# Altium schematic sheet 03_POWER.SchDoc: =GlobalProjectName
size 594 x 420 mm; CheckedBy: A_D; Author: A_D; SheetNumber: 3; SheetTotal: 3; PageSetup: Record=PageOptions|CenterHorizontal=True|CenterVertical=True|PrintScale=0.70|XCorrection=1.00|YCorrection=1.00|PrintKind=2|BorderSize=5000000|LeftOffset=9000|BottomOffset=10100|Orientation=2|PaperLength=11176|PaperWidth=8636|Scale=100|PaperSource=259|PrintQuality=-3|MediaType=1|DitherType=10|PrintScaleMode=1|PaperKind=A3|PaperIndex=8
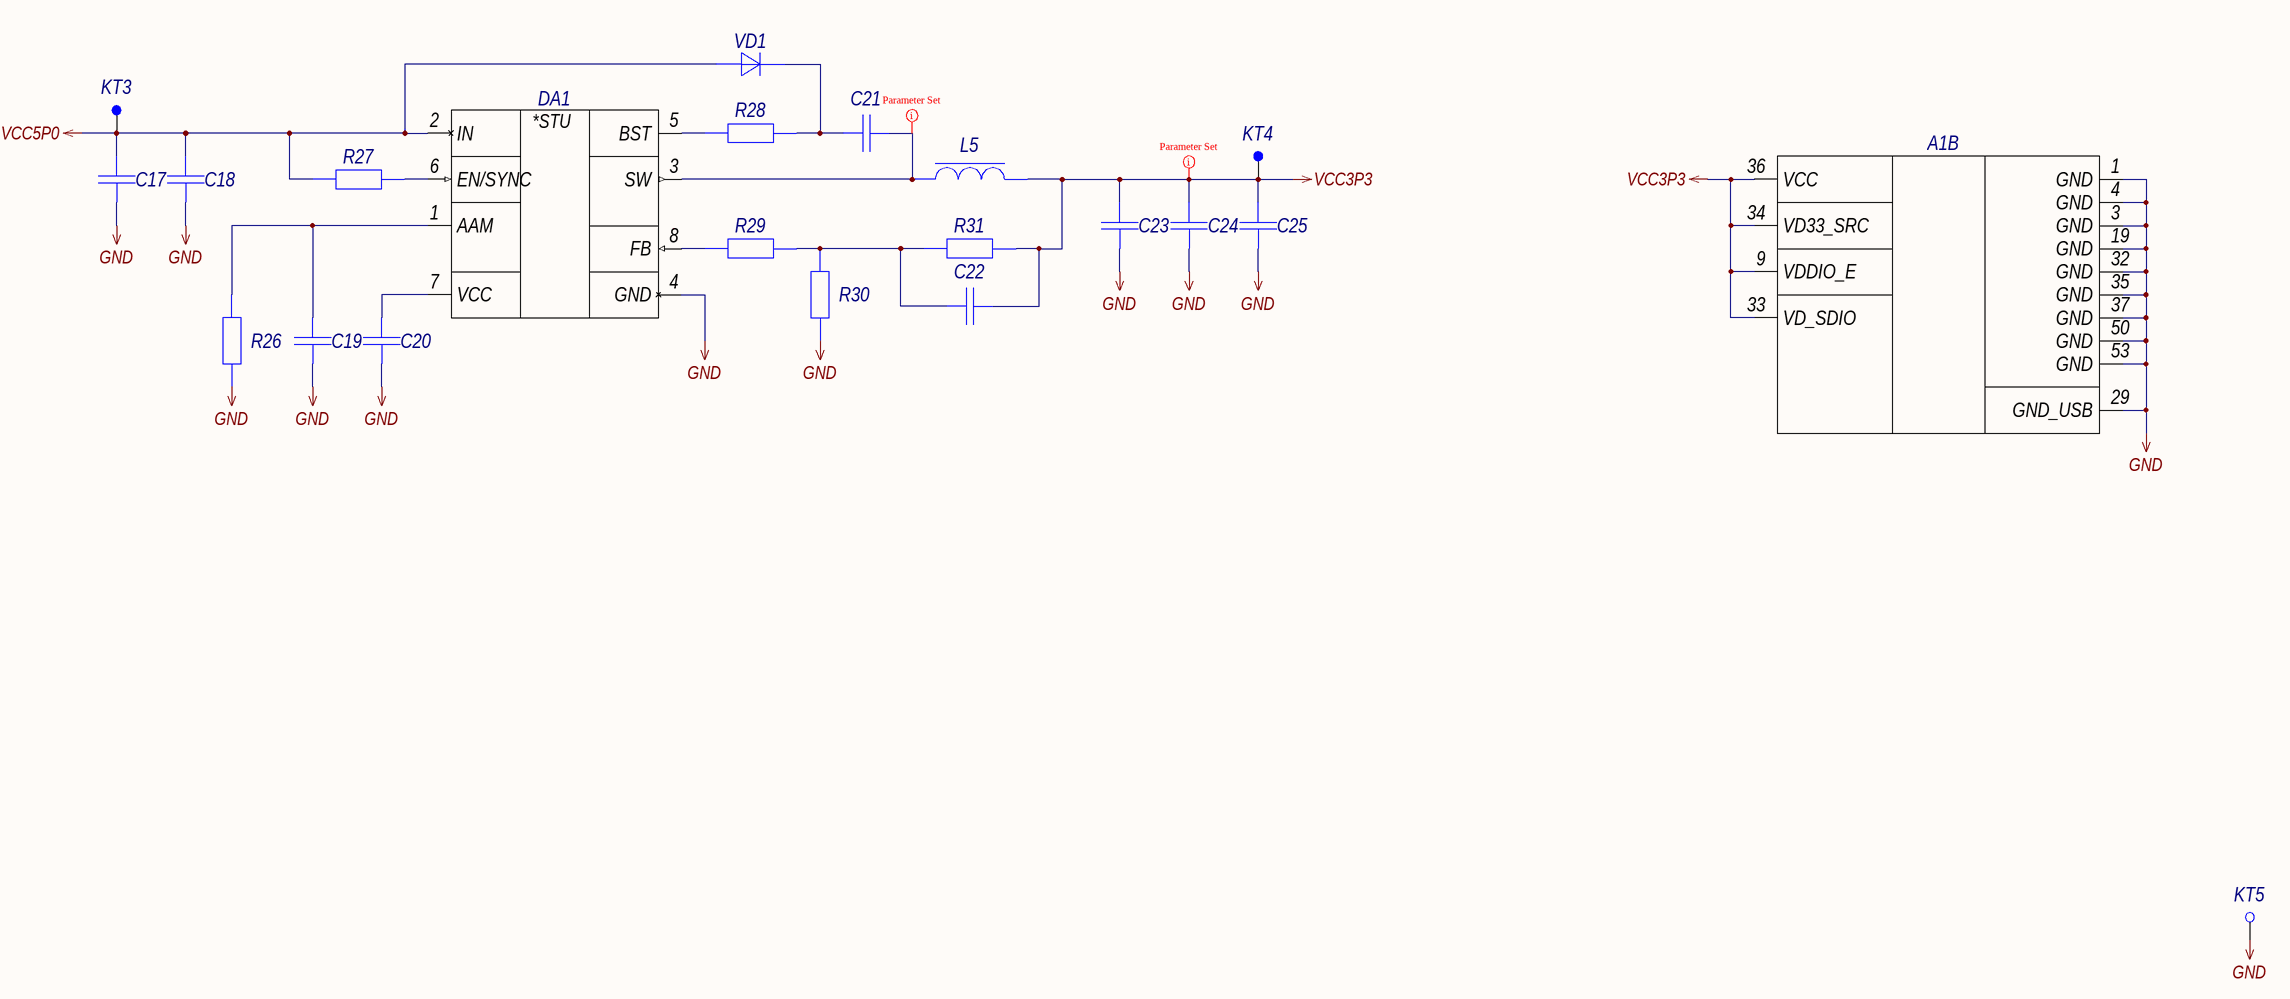
[diagram p0: 03_POWER.SchDoc]

## Parts
A1  AMB-02  [AMB-02]  (value not drawn)  (part B of 2)
C17  Capacitor  [C0805_L]  (value not drawn)
C18  Capacitor  [C0603_L]  (value not drawn)
C19  Capacitor  [C0603_L]  (value not drawn)
C20  Capacitor  [C0603_L]  (value not drawn)
C21  Capacitor  [C0603_L]  (value not drawn)
C22  Capacitor  [C0603_L]  (value not drawn)
C23  Capacitor  [C0805_L]  (value not drawn)
C24  Capacitor  [C0805_L]  (value not drawn)
C25  Capacitor  [C0805_L]  (value not drawn)
DA1  MP2315GJ  [TSOT-23-8_065P290X160X100_N]  (value not drawn)
KT3  +5V  [TP-SMT-C-0.8mm]  (value not drawn)  (no BOM)
KT4  +3.3V  [TP-SMT-C-0.8mm]  (value not drawn)  (no BOM)
KT5  GND  [5001]  (value not drawn)  (no BOM)
L5  Coil  [SRP4020TA-Series]  (value not drawn)
R26  Resistor  [R0603_L]  (value not drawn)
R27  Resistor  [R0603_L]  (value not drawn)
R28  Resistor  [R0603_L]  (value not drawn)
R29  Resistor  [R0603_L]  (value not drawn)
R30  Resistor  [R0603_L]  (value not drawn)
R31  Resistor  [R0603_L]  (value not drawn)
VD1  Diode  [SOD-323]  (value not drawn)

## Nets
GND: A1.1(GND) A1.3(GND) A1.4(GND) A1.19(GND) A1.29(GND_USB) A1.32(GND) A1.35(GND) A1.37(GND) A1.50(GND) A1.53(GND) C17.1 C18.1 C19.1 C20.1 C23.1 C24.1 C25.1 DA1.4(GND) KT5.1 R26.1 R30.1
VCC3P3: A1.9(VDDIO_E) A1.33(VD_SDIO) A1.34(VD33_SRC) A1.36(VCC) C22.2 C23.2 C24.2 C25.2 KT4.1 L5.2 R31.2
VCC5P0: C17.2 C18.2 DA1.2(IN) KT3.1 R27.1 VD1.1(А)
NetC19_2: C19.2 DA1.1(AAM) R26.2
NetC20_2: C20.2 DA1.7(VCC)
NetC21_1: C21.1 R28.2 VD1.2(К)
NetC21_2: C21.2 DA1.3(SW) L5.1
NetC22_1: C22.1 R29.2 R30.2 R31.1
NetDA1_5: DA1.5(BST) R28.1
NetDA1_6: DA1.6(EN/SYNC) R27.2
NetDA1_8: DA1.8(FB) R29.1

## Layout directives
rule Polygon Connect Style [Style - Direct Connect]: NetC21_2, VCC3P3

## Notes on the sheet
- Подп. и дата
- Инв. № дубл.
- Взам. инв. №
- Инв. № подл.
- Изм.
- Лист
- № докум.
- Подп.
- Дата
- Форма 2а ГОСТ 2.104-2006
- Копировал
- Формат А2
- (in symbol MP2315GJ-Z) *STU

## Library data of the parts
A1 = MJIOT-AMB-02: Manufacturer: MJIOT; ID: 3; Supply Operation: +3.0…3.6V; Supply Current: 450mA; ROM/RAM: 1MB/2MB+512KB; Wireless Compatibility: 802.11 b/g/n; Supported Interfaces: JTAG, SWD, SPI, I2C, I2S, UART, PWM, PCM, SDIO, NFC, ADC, DAC, USB HS, MII/RMII; I/O Lines: 30; Operation Frequency: 166MHz; Application Category: 1; Working Temperature Min: -20°С; Working Temperature Max: +85°С; Published: 12.12.2017; Publisher: Andrew Danich; Type: Модуль; Part Number: MJIOT-AMB-02; Value: MJIOT-AMB-02
C17 C23-C25 = GRM21BR60J226ME39L: Manufacturer: Murata; Type: Конденсатор; ID: 140; Value: 22uF; Voltage: 6.3V; Tolerance: ±20%; Dielectric Type: X5R; Application Category: 1; Working Temperature Min: -55°С; Working Temperature Max: +85°С; Published: 18.05.2010; Publisher: Andrew Danich; Part Number: GRM21BR60J226ME39L; Footprint: 0805; ClassName: DirectConnect
C18 C20 C21 = GRM188R72A104KA35D: Manufacturer: Murata; Type: Конденсатор; ID: 232; Value: 0.1uF; Voltage: 100V; Tolerance: ±10%; Dielectric Type: X7R; Application Category: 1; Working Temperature Min: -55°С; Working Temperature Max: +125°С; Published: 18.05.2010; Publisher: Andrew Danich; Part Number: GRM188R72A104KA35D; Footprint: 0603
  C18: ClassName: DirectConnect
C19 = GRM1885C2A102JA01D: Manufacturer: Murata; Type: Конденсатор; ID: 135; Value: 1000pF; Voltage: 100V; Tolerance: ±5%; Dielectric Type: NP0; Application Category: 1; Working Temperature Min: -55°С; Working Temperature Max: +125°С; Published: 18.05.2010; Publisher: Andrew Danich; Part Number: GRM1885C2A102JA01D; Footprint: 0603
C22 = GRM1885C1H330JA01D: Manufacturer: Murata; Type: Конденсатор; ID: 123; Value: 33pF; Voltage: 50V; Tolerance: ±5%; Dielectric Type: NP0; Application Category: 1; Working Temperature Min: -55°С; Working Temperature Max: +125°С; Published: 18.05.2010; Publisher: Andrew Danich; Part Number: GRM1885C1H330JA01D; Footprint: 0603
DA1 = MP2315GJ-Z: Manufacturer: Monolithic Power Systems; ID: 38; Input Voltage: +4.5…24V; Output Current: 3A; Output Voltage: +0.8…22.8V; Shutdown Input: YES; Frequency: 500kHz; Application Category: 1; Working Temperature Min: -40°С; Working Temperature Max: +125°С; Functional Analog: MP2315GJ-P; Type: Микросхема; Published: 01.09.2018; Publisher: Andrew Danich; Part Number: MP2315GJ-Z; Value: MP2315GJ-Z; ClassName: DirectConnect
KT3 KT4 = TestPoint-SMT: ID: 6; Application Type: On PCB Test Point; Application Category: 1; Published: 03.03.2015; Publisher: Andrew Danich; Part Number: TestPoint-SMT; Value: TestPoint-SMT; Manufacturer: -; Functional Analog: -
KT5 = 5001: Manufacturer: Keystone Electronics; ID: 2; Value: 5001; Limit Voltage: 100V; Rated Current: 0.5A; Application Type: Miniature THM Test Point; Application Category: 1; Published: 03.03.2015; Publisher: Andrew Danich; Part Number: 5001; Functional Analog: -
L5 = SRP4020TA-4R7M: Manufacturer: Bourns; Type: Дроссель; ID: 103; Rated Current: 2.6A; Tolerance: ±20%; Inductance: 4.7uH; Q: 10; DC Resistance: 0.105ohm; Self-Resonant Frequency: 27MHz; Application Category: 1; Working Temperature Min: -40°С; Working Temperature Max: +125°С; Published: 20.05.2010; Publisher: Andrew Danich; Part Number: SRP4020TA-4R7M; Value: SRP4020TA-4R7M; Footprint: SRP4020TA; ClassName: DirectConnect
R26 = RC0603FR-0763K4L: Manufacturer: Yageo; ID: 468; Value: 63.4k; Limit Voltage: 50V; Tolerance: ±1%; Temperature Coefficient: 100ppm; Total Power Dissipation: 0.1W; Series Type: Thick-Film; Application Category: 1; Working Temperature Min: -55°С; Working Temperature Max: +155°С; Published: 24.03.2010; Publisher: Andrew Danich; Type: Резистор; Part Number: RC0603FR-0763K4L; Footprint: 0603
R27 = RC0603JR-07100KL: Manufacturer: Yageo; ID: 11; Value: 100k; Limit Voltage: 50V; Tolerance: ±5%; Temperature Coefficient: 100ppm; Total Power Dissipation: 0.1W; Series Type: Thick-Film; Application Category: 1; Working Temperature Min: -55°С; Working Temperature Max: +155°С; Functional Analog: CR0603-JW-104E; Published: 24.03.2010; Publisher: Andrew Danich; Type: Резистор; Part Number: RC0603JR-07100KL; Footprint: 0603
R28 = RC0603JR-0720RL: Manufacturer: Yageo; ID: 469; Value: 20; Limit Voltage: 50V; Tolerance: ±5%; Temperature Coefficient: 100ppm; Total Power Dissipation: 0.1W; Series Type: Thick-Film; Application Category: 1; Working Temperature Min: -55°С; Working Temperature Max: +155°С; Published: 24.03.2010; Publisher: Andrew Danich; Type: Резистор; Part Number: RC0603JR-0720RL; Footprint: 0603
R29 = RC0603JR-0733KL: Manufacturer: Yageo; ID: 47; Value: 33k; Limit Voltage: 50V; Tolerance: ±5%; Temperature Coefficient: 100ppm; Total Power Dissipation: 0.1W; Series Type: Thick-Film; Application Category: 1; Working Temperature Min: -55°С; Working Temperature Max: +155°С; Published: 24.03.2010; Publisher: Andrew Danich; Type: Резистор; Part Number: RC0603JR-0733KL; Footprint: 0603
R30 = RC0603FR-0712K7L: Manufacturer: Yageo; ID: 263; Value: 12.7k; Limit Voltage: 50V; Tolerance: ±1%; Temperature Coefficient: 100ppm; Total Power Dissipation: 0.1W; Series Type: Thick-Film; Application Category: 1; Working Temperature Min: -55°С; Working Temperature Max: +155°С; Published: 24.03.2010; Publisher: Andrew Danich; Type: Резистор; Part Number: RC0603FR-0712K7L; Footprint: 0603
R31 = RC0603FR-0740K2L: Manufacturer: Yageo; ID: 294; Value: 40.2k; Limit Voltage: 50V; Tolerance: ±1%; Temperature Coefficient: 100ppm; Total Power Dissipation: 0.1W; Series Type: Thick-Film; Application Category: 1; Working Temperature Min: -55°С; Working Temperature Max: +155°С; Published: 24.03.2010; Publisher: Andrew Danich; Type: Резистор; Part Number: RC0603FR-0740K2L; Footprint: 0603
VD1 = 1N4148WS-7-F: Manufacturer: Diodes Incorporated; Type: Диод; ID: 13; Reverse Voltage: 100V; Reverse Current: 1uA; Forward Voltage: 1V; Forward Current: 150mA; Total Power Dissipation: 200mW; Capacitance: 2pF; Recovery Time: 4nS; Application Category: 1; Working Temperature Min: -55°С; Working Temperature Max: +150°С; Published: 18.05.2010; Publisher: Andrew Danich; Part Number: 1N4148WS-7-F; Value: 1N4148WS-7-F; Functional Analog: 1N4148WS